# Altium schematic sheet 3_STM32H750VBT6.schdoc.schdoc
size 309 x 223 mm; Symbol: Sheet-Symbol_A4; Device: Sheet-Symbol_A4; @Page Name: STM32H750VBT6; @Create Date: 2023-11-30; @Page Count: 13; @Page No: 1; @Project Name: STM32F722RET6; @Schematic Name: 开发板; @Update Date: 2023-12-01; Company: 嘉立创EDA; Page Size: A4; Version: V1.0
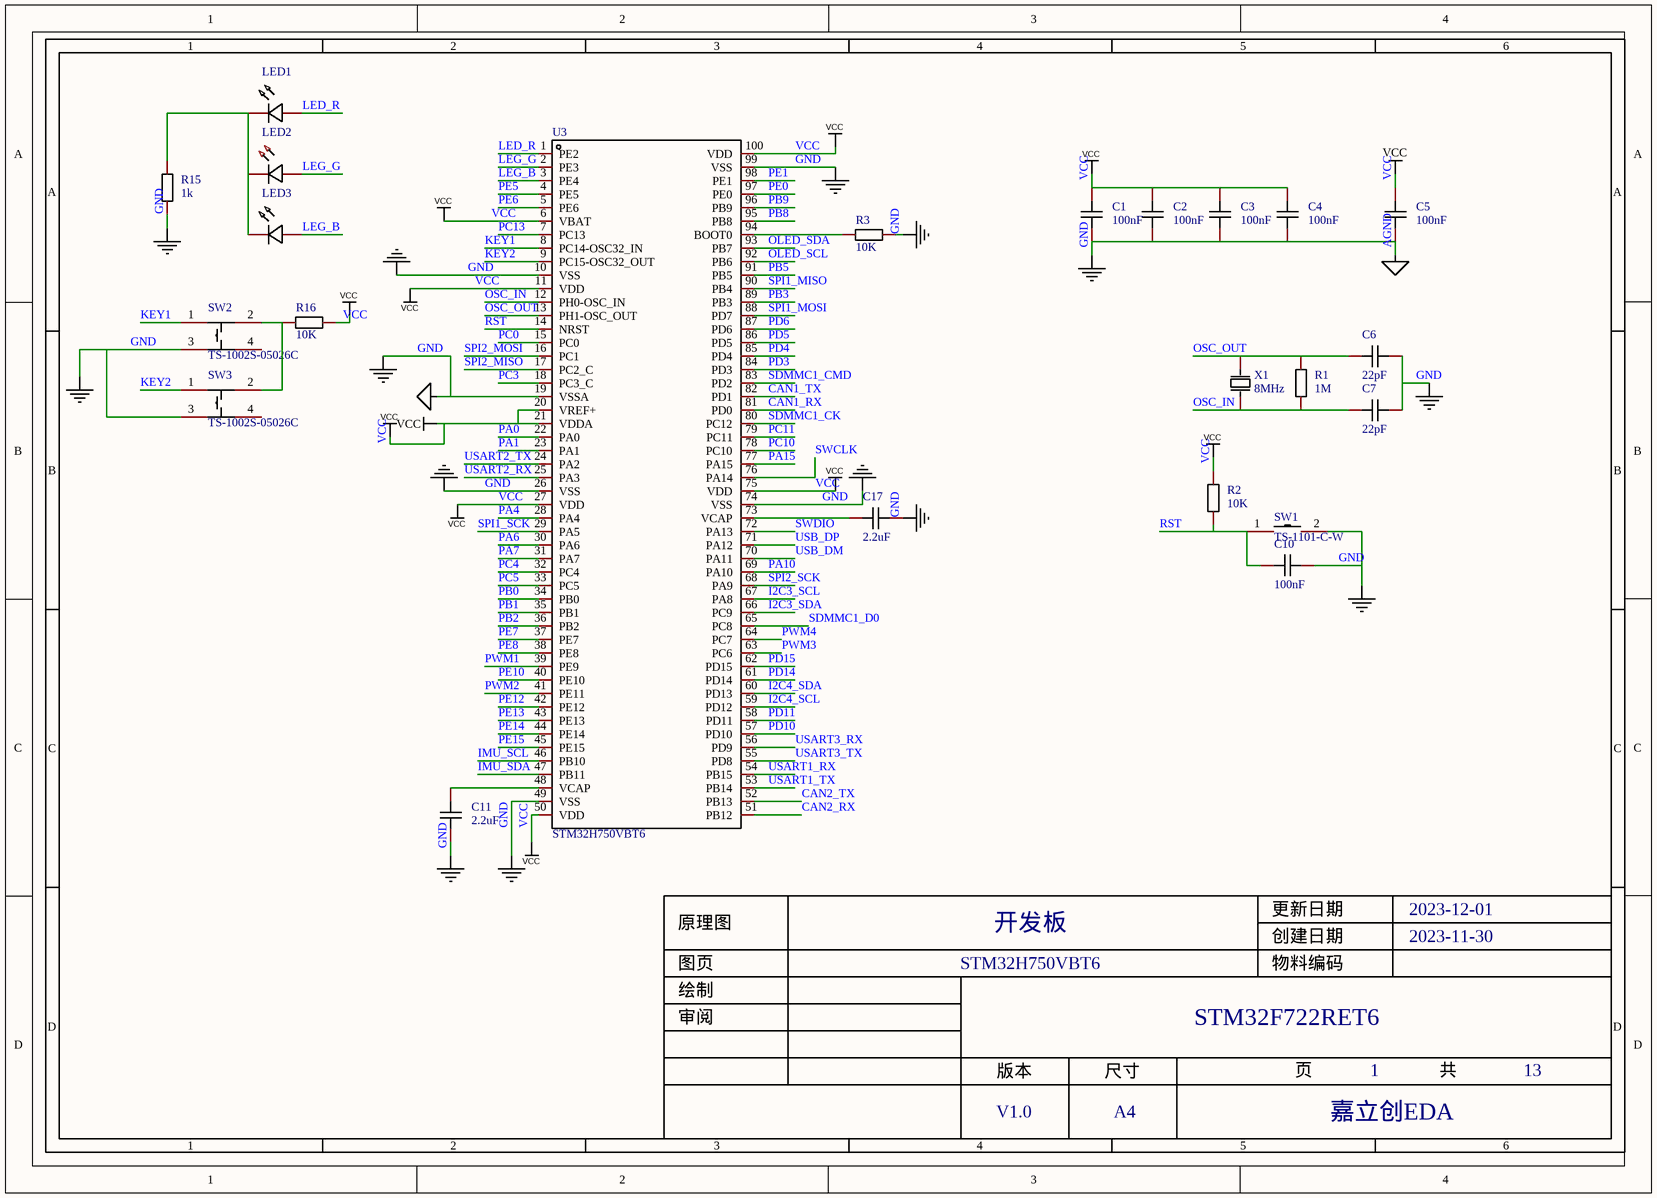
[diagram p0: 3_STM32H750VBT6.schdoc.schdoc]

## Parts
C1  100nF  [C0805]
C2  100nF  [C0805]
C3  100nF  [C0805]
C4  100nF  [C0805]
C5  100nF  [C0805]
C6  22pF  [C0603]
C7  22pF  [C0603]
C10  100nF  [C0603]
C11  2.2uF  [C0603]
C17  2.2uF  [C0603]
LED1  LED_0603-R  [LED_0603]  (value not drawn)
LED2  LED_0603-G  [LED_0603]  (value not drawn)
LED3  LED_0603-B  [LED_0603]  (value not drawn)
R1  1M  [R0603]
R2  10K  [R0603]
R3  10K  [R0603]
R15  1k  [R0603]
R16  10K  [R0603]
SW1  TS-1101-C-W  [SW-SMD_L6.0-W3.3-LS8.0]
SW2  TS-1002S-05026C  [KEY-SMD_4P-L6.0-W6.0-P4.50-LS9.0]
SW3  TS-1002S-05026C  [KEY-SMD_4P-L6.0-W6.0-P4.50-LS9.0]
U3  STM32H750VBT6  [LQFP-100_L14.0-W14.0-P0.50-LS16.0-BL]
X1  8MHz  [CRYSTAL-SMD_L11.5-W4.8-LS12.7]

## Nets
AGND: C1.1 C2.1 C3.1 C4.1 C5.1 C6.2 C7.2 C10.2 C11.1 C17.1 R3.1 R15.1 SW1.2 SW2.3 SW3.3 U3.10(VSS) U3.19(VSSA) U3.26(VSS) U3.49(VSS) U3.74(VSS) U3.99(VSS)  [also labelled GND]
VCC: C1.2 C2.2 C3.2 C4.2 C5.2 R2.2 R16.2 U3.6(VBAT) U3.11(VDD) U3.20(VREF+) U3.21(VDDA) U3.27(VDD) U3.50(VDD) U3.75(VDD) U3.100(VDD)
CAN1_RX: U3.81(PD0)
CAN1_TX: U3.82(PD1)
CAN2_RX: U3.51(PB12)
CAN2_TX: U3.52(PB13)
I2C3_SCL: U3.67(PA8)
I2C3_SDA: U3.66(PC9)
I2C4_SCL: U3.59(PD12)
I2C4_SDA: U3.60(PD13)
IMU_SCL: U3.46(PB10)
IMU_SDA: U3.47(PB11)
KEY1: SW2.1 U3.8(PC14-OSC32_IN)
KEY2: SW3.1 U3.9(PC15-OSC32_OUT)
LED_R: LED1.2(A) U3.1(PE2)
LEG_B: LED3.2(A) U3.3(PE4)
LEG_G: LED2.2(A) U3.2(PE3)
OLED_SCL: U3.92(PB6)
OLED_SDA: U3.93(PB7)
OSC_IN: C7.1 R1.2 U3.12(PH0-OSC_IN) X1.1(OSC1)
OSC_OUT: C6.1 R1.1 U3.13(PH1-OSC_OUT) X1.2(OSC2)
PA0: U3.22(PA0)
PA1: U3.23(PA1)
PA4: U3.28(PA4)
PA6: U3.30(PA6)
PA7: U3.31(PA7)
PA10: U3.69(PA10)
PA15: U3.77(PA15)
PB0: U3.34(PB0)
PB1: U3.35(PB1)
PB2: U3.36(PB2)
PB3: U3.89(PB3)
PB5: U3.91(PB5)
PB8: U3.95(PB8)
PB9: U3.96(PB9)
PC0: U3.15(PC0)
PC3: U3.18(PC3_C)
PC4: U3.32(PC4)
PC5: U3.33(PC5)
PC10: U3.78(PC10)
PC11: U3.79(PC11)
PC13: U3.7(PC13)
PD3: U3.84(PD3)
PD4: U3.85(PD4)
PD5: U3.86(PD5)
PD6: U3.87(PD6)
PD10: U3.57(PD10)
PD11: U3.58(PD11)
PD14: U3.61(PD14)
PD15: U3.62(PD15)
PE0: U3.97(PE0)
PE1: U3.98(PE1)
PE5: U3.4(PE5)
PE6: U3.5(PE6)
PE7: U3.37(PE7)
PE8: U3.38(PE8)
PE10: U3.40(PE10)
PE12: U3.42(PE12)
PE13: U3.43(PE13)
PE14: U3.44(PE14)
PE15: U3.45(PE15)
PWM1: U3.39(PE9)
PWM2: U3.41(PE11)
PWM3: U3.63(PC6)
PWM4: U3.64(PC7)
RST: C10.1 R2.1 SW1.1 U3.14(NRST)
SDMMC1_CK: U3.80(PC12)
SDMMC1_CMD: U3.83(PD2)
SDMMC1_D0: U3.65(PC8)
SPI1_MISO: U3.90(PB4)
SPI1_MOSI: U3.88(PD7)
SPI1_SCK: U3.29(PA5)
SPI2_MISO: U3.17(PC2_C)
SPI2_MOSI: U3.16(PC1)
SPI2_SCK: U3.68(PA9)
SWCLK: U3.76(PA14)
SWDIO: U3.72(PA13)
USART1_RX: U3.54(PB15)
USART1_TX: U3.53(PB14)
USART2_RX: U3.25(PA3)
USART2_TX: U3.24(PA2)
USART3_RX: U3.56(PD9)
USART3_TX: U3.55(PD8)
USB_DM: U3.70(PA11)
USB_DP: U3.71(PA12)
NetC11_2: C11.2 U3.48(VCAP)
NetC17_2: C17.2 U3.73(VCAP)
NetLED1_1: LED1.1(C) LED2.1(C) LED3.1(C) R15.2
NetR3_2: R3.2 U3.94(BOOT0)
NetR16_1: R16.1 SW2.2 SW3.2

Not connected (* = marked no-connect by the designer): SW2 4; SW3 4

## Notes on the sheet
- 1
- 2
- 3
- 4
- 5
- 6
- A
- B
- C
- 原理图
- 开发板
- 创建日期
- 更新日期
- 2023-11-30
- 2023-12-01
- 审阅
- 绘制
- 图页
- STM32H750VBT6
- 物料编码
- STM32F722RET6
- D
- 版本
- 尺寸
- 页
- 共
- 13
- V1.0
- A4
- 嘉立创EDA

## Library data of the parts
C1-C5 = CAP_0805: Symbol: CapAcitance; Convert to PCB: yes; Name: 100nF; Device: CAP_0805; Add into BOM: yes; Supplier Footprint: 0805; Value: 100nF
C6 C7 C10 C11 C17 = CAP_0603: Symbol: CapAcitance; Convert to PCB: yes; Device: CAP_0603; Add into BOM: yes; Supplier Footprint: 0603
  C6 C7: Name: 22pF; Value: 22pF
  C10: Name: 100nF; Value: 100nF
  C11 C17: Name: 2.2uF; Value: 2.2uF
LED1 = LED_0603-R: Symbol: LED_R; Convert to PCB: yes; Device: LED_0603-R; Add into BOM: yes; Supplier Footprint: 0603
LED2 = LED_0603-G: Symbol: LED_G; Convert to PCB: yes; Device: LED_0603-G; Add into BOM: yes; Supplier Footprint: 0603
LED3 = LED_0603-B: Symbol: LED_B; Convert to PCB: yes; Device: LED_0603-B; Add into BOM: yes; Supplier Footprint: 0603
R1-R3 R15 R16 = Res_0603: Symbol: 电阻; Convert to PCB: yes; Device: Res_0603; Add into BOM: yes; Supplier Footprint: 0603
  R1: Name: 1M; Value: 1M
  R2 R3 R16: Name: 10K; Value: 10K
  R15: Name: 1k; Value: 1k
SW1 = TS-1101-C-W: 电路结构:单刀单掷;带支架:否;触点电流:50mA;额定电压(AC):-;额定电压(DC):12V;额定功率:-;安装方式:立贴;绝缘电阻:-;带灯:无;作用力:260gf;机械寿命:5万次;; Manufacturer: XKB Connectivity(中国星坤); Add into BOM: yes; Circuit: 单刀单掷; Actuator Style: 矩形按钮; Switch Length: 6mm; Switch Width: 3.6mm; Switch Height: 2.5mm; Strike Gundam: 否; Contact Current: 50mA; Voltage Rating (DC): 12V; Actuator/Cap Color: 白色带淡绿; With Lamp: 无; Operating Force: 260gf; Mechanical Life: 5万次; Name: TS-1101-C-W; Symbol: TS-1101-C-W; Device: TS-1101-C-W; LCSC Part Name: 6*3.6*2.5mm 立贴 轻触开关 白色带淡绿按键 卷装; Supplier Part: C318938; Manufacturer Part: TS-1101-C-W; Supplier Footprint: SMD; JLCPCB Part Class: 扩展库; Datasheet: https://atta.szlcsc.com/upload/public/pdf/source/20200227/C318938_C2E53B1EEDE37D980A33616AC086DE53.pdf; Supplier: LCSC; Convert to PCB: yes; Voltage Rating (AC): -; Power Rating: -; Mounting Style: 立贴; Insulation Resistance: -; IP Rating: -; Pin Style: -; Operating Temperature: -30℃~+85℃
SW2 SW3 = TS-1002S-05026C: 电路结构:单刀单掷;触点电流:50mA;额定电压(DC):12V;安装方式:立贴;带灯:-;机械寿命:-;; Manufacturer: XUNPU(讯普); Add into BOM: yes; Circuit: 单刀单掷; Actuator Style: 圆形按钮; Switch Length: 6mm; Switch Height: 5mm; Contact Current: 50mA; Voltage Rating (DC): 12V; Name: TS-1002S-05026C; Symbol: TS-1002S-05026C; Device: TS-1002S-05026C; LCSC Part Name: 6*6*5mm 立贴 轻触开关; Supplier Part: C455110; Manufacturer Part: TS-1002S-05026C; Supplier Footprint: SMD,6x6mm; JLCPCB Part Class: Extended Part; Datasheet: https://atta.szlcsc.com/upload/public/pdf/source/20191118/C455126_F61E8FA1ED640FB1CE0B30B55DEB62E3.pdf; Supplier: LCSC; Convert to PCB: yes; Switch Width: 6mm; Mounting Style: 立贴; With Lamp: -; Mechanical Life: -
U3 = STM32H750VBT6: CPU内核:ARM-M系列;CPU最大主频:480MHz;工作电压范围:1.62V~3.6V;程序存储容量:128KB;程序存储器类型:FLASH;RAM总容量:1MB;GPIO端口数量:82;; Manufacturer: ST(意法半导体); Add into BOM: yes; CPU Maximum Speed: 480MHz; Program Storage Size: 128KB; Program Memory Type: FLASH; RAM Size: 1MB; GPIO Ports Number: 82; ADC (Bit): 16bit; DAC (Bit): 12bit; Universal Serial Bus: 有; Peripheral/Function: DMA；LCD/LED驱动; Name: STM32H750VBT6; Symbol: STM32H750VBT6; Device: STM32H750VBT6; LCSC Part Name: STM32H750VBT6; Supplier Part: C404010; Manufacturer Part: STM32H750VBT6; Supplier Footprint: LQFP-100(14x14); JLCPCB Part Class: 扩展库; Datasheet: https://atta.szlcsc.com/upload/public/pdf/source/20231008/912982D4F3BD3DF1AA7D0A7EE6EF5B6B.pdf; Supplier: LCSC; Convert to PCB: yes; CPU Core: ARM-M系列; Operating Voltage Range: 1.62V~3.6V; EEPROM: -; PWM (Bit): -; Internal Comparator: -; communication protocol: -; Watchdog: 有; Real-Time Clock: -; Infrared Data Association: 有; Low-Voltage Detect: 有; CCP Capture/Compare: -; LCD Module: 有; Secure Digital Input and Output: 有; Direct Memory Access: 有; Internal Oscillator: 有; Operating Temperature Range: -40℃~+85℃
X1 = X49SM8MSD2SC: 频率:8MHz;负载电容:20pF;频率公差:±20ppm;; Manufacturer: YXC(扬兴晶振); Add into BOM: yes; Crystal Type: 49SMD; Load Capacitance: 20pF; Frequency Tolerance: ±20ppm; Frequency Stability: ±30ppm; Name: 8MHz; Symbol: X49SM8MSD2SC; Device: X49SM8MSD2SC; LCSC Part Name: 8MHz ±20ppm 20pF HC-49SMD; Supplier Part: C12674; Manufacturer Part: X49SM8MSD2SC; Supplier Footprint: HC-49S-SMD; JLCPCB Part Class: 基础库; Datasheet: https://atta.szlcsc.com/upload/public/pdf/source/20210329/C106809_0E91E60850A780B284B63D653DC40EA4.pdf; Supplier: LCSC; Convert to PCB: yes; Value: 8MHz; Operating Temperature: -20℃~+70℃